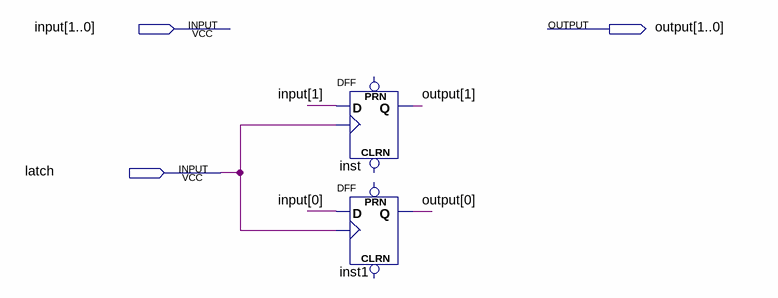
[diagram p0: schematic sheet]
// Quartus schematic 2bitregister.bdf as structural Verilog: 2 symbols, 3 pins
module \2bitregister  (
  input  [1:0] \input ,
  input  latch,
  output [1:0] \output 
);

  DFF inst (.CLK(latch), .D(\input [1]), .Q(\output [1]));  // open: CLRN, PRN
  DFF inst1 (.CLK(latch), .D(\input [0]), .Q(\output [0]));  // open: CLRN, PRN
endmodule
